# EAGLE schematic RS232_SelfPowered_Opto (EAGLE 7.6.0)
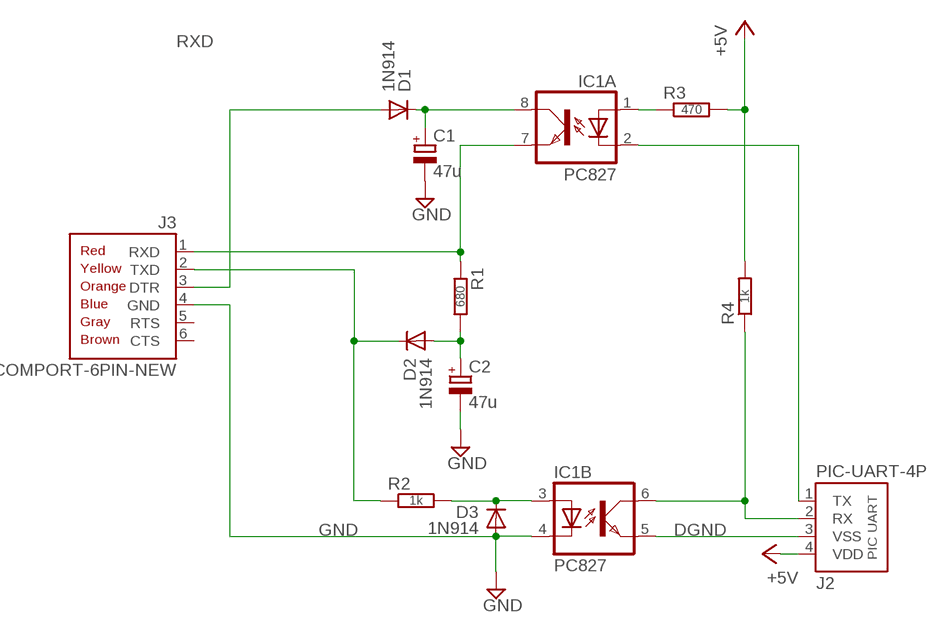
[diagram p0: schematic, sheet 1]

## Parts
C1  47u  CPOL-EUE2.5-5  [E2,5-5]
C2  47u  CPOL-EUE2.5-5  [E2,5-5]
D1  1N914  1N414834-7V  [DO34-7V]
D2  1N914  1N414834-7  [DO34-7]
D3  1N914  1N414834-7V  [DO34-7V]
IC1  PC827  ACPL-827  [DIL08]
J2  PIC-UART-4P  [CONN-4P]
J3  COMPORT-6PIN-NEW  [RS232-6PIN-NEW]
R1  680  R0202/7  [0202/7]
R2  1k  R0202/7  [0202/7]
R3  470  R0202/10-V  [0202/10-V]
R4  1k  R0202/7-V  [0202/7-V]

## Nets
+5V: J2.4(VDD) R3.2 R4.2
DGND: IC1.5(B:EMIT) J2.3(VSS)
DTR: D1.A J3.3(DTR)
GND: C1.- C2.- D3.A IC1.4(B:C) J3.4(GND)
N$2: C1.+ D1.C IC1.8(A:COL)
N$3: IC1.1(A:A) R3.1
N$4: IC1.2(A:C) J2.1(TX)
N$5: IC1.6(B:COL) J2.2(RX) R4.1
N$6: D3.C IC1.3(B:A) R2.2
N$9: C2.+ D2.A R1.2
RXD: IC1.7(A:EMIT) J3.1(RXD) R1.1
TXD: D2.C J3.2(TXD) R2.1
Unconnected: J3.5(RTS) J3.6(CTS)

## Library data of the parts
C1 C2 = rcl:CPOL-EU: POLARIZED CAPACITOR, European symbol
D1-D3 = d:1N4148
IC1 = opto-c:ACPL-827
J2 = pinconn:PIC-UART
J3 = pinconn:COMPORT-6PIN-NEW
R1-R4 = r:R: RESISTOR, European symbol

## Net classes
0 default: drill 0.001 mm